# Altium schematic sheet ALL.SchDoc
size A4
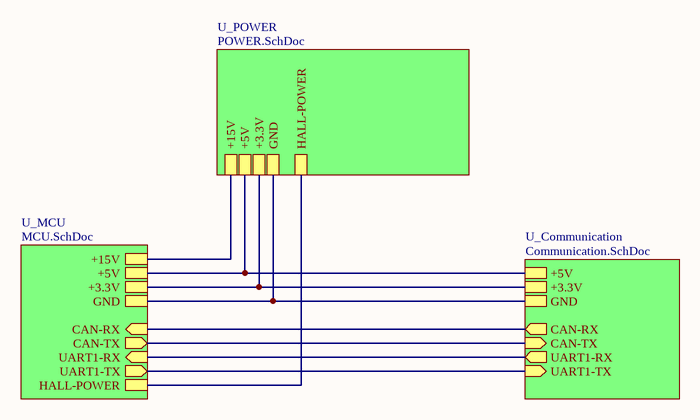
[diagram p0: ALL.SchDoc]

## Sub-sheets
U_Communication = Communication.SchDoc: UART1-RX (out), UART1-TX (in), CAN-TX (in), CAN-RX (out), +5V, +3.3V, GND
U_MCU = MCU.SchDoc: CAN-TX (out), CAN-RX (in), +5V, +3.3V, +15V, GND, UART1-TX (out), UART1-RX (in), HALL-POWER
U_POWER = POWER.SchDoc: +5V, +3.3V, +15V, GND, HALL-POWER

## Nets
(unnamed): sheet U_Communication/UART1-RX, sheet U_MCU/UART1-RX
(unnamed): sheet U_Communication/UART1-TX, sheet U_MCU/UART1-TX
(unnamed): sheet U_Communication/CAN-TX, sheet U_MCU/CAN-TX
(unnamed): sheet U_Communication/CAN-RX, sheet U_MCU/CAN-RX
(unnamed): sheet U_Communication/+5V, sheet U_MCU/+5V, sheet U_POWER/+5V
(unnamed): sheet U_Communication/+3.3V, sheet U_MCU/+3.3V, sheet U_POWER/+3.3V
(unnamed): sheet U_Communication/GND, sheet U_MCU/GND, sheet U_POWER/GND
(unnamed): sheet U_MCU/+15V, sheet U_POWER/+15V
(unnamed): sheet U_MCU/HALL-POWER, sheet U_POWER/HALL-POWER